# Altium schematic sheet Sheet_1_2021-08-28_22-45-47.schdoc
size 304 x 175 mm
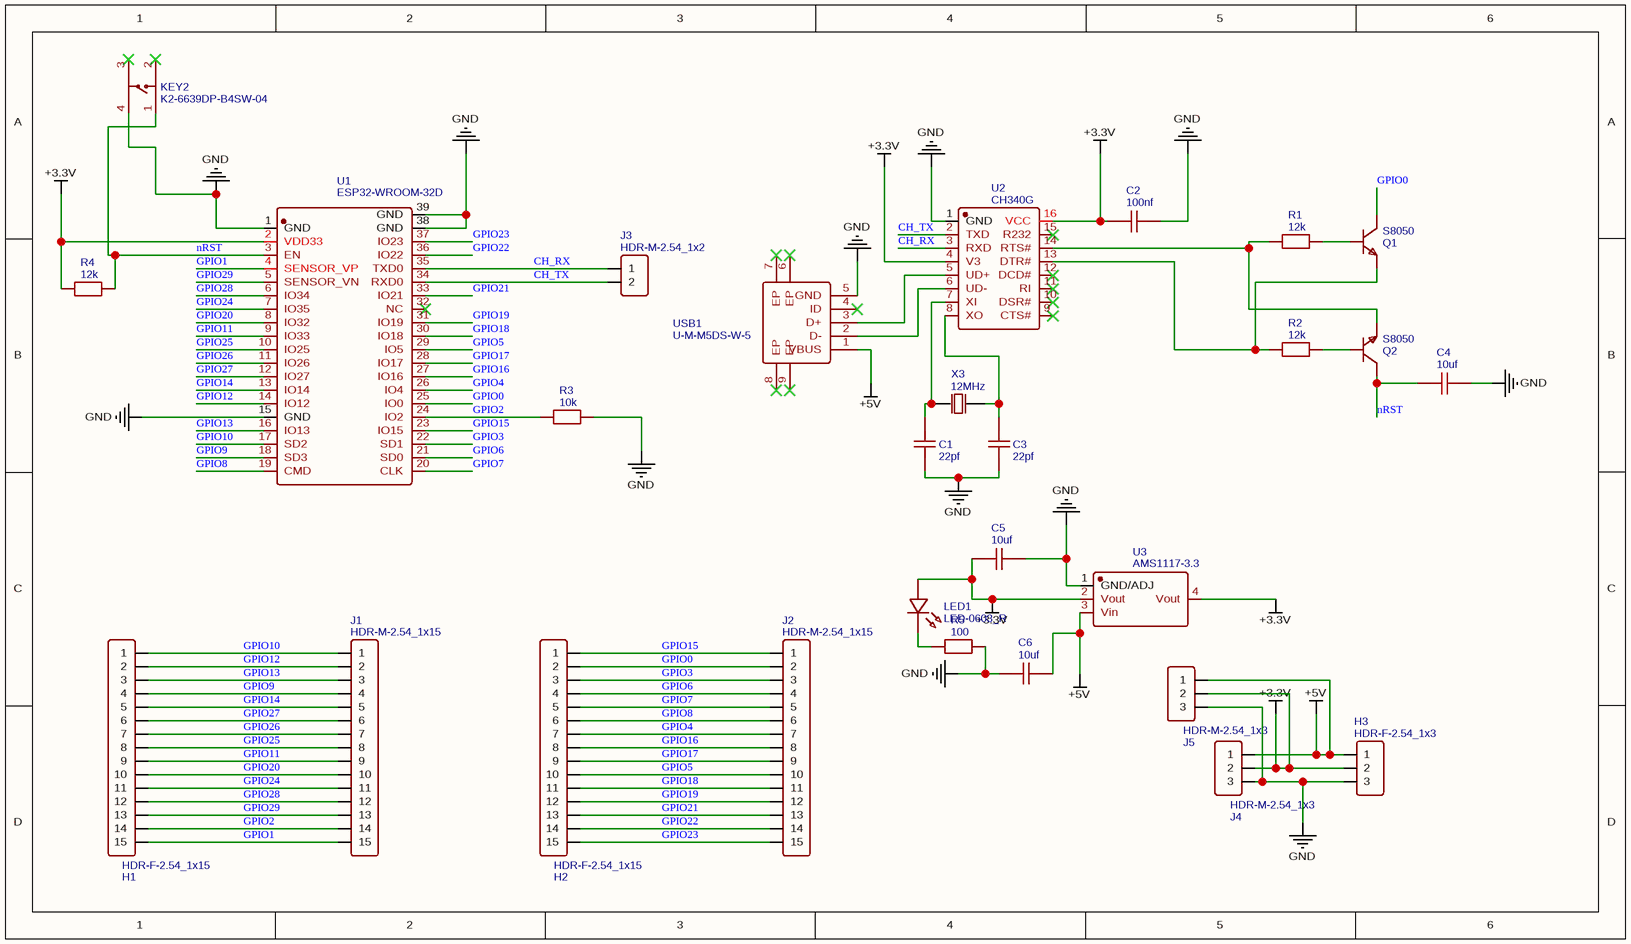
[diagram p0: Sheet_1_2021-08-28_22-45-47.schdoc]

## Parts
C1  22pf  [CAP-TH_L5.0-W5.0-P5.08-D1.0-L]
C2  100nf  [CAP-TH_L5.0-W5.0-P5.08-D1.0-L]
C3  22pf  [CAP-TH_L5.0-W5.0-P5.08-D1.0-L]
C4  10uf  [CAP-TH_L5.0-W5.0-P5.08-D1.0-L]
C5  10uf  [CAP-TH_L5.0-W5.0-P5.08-D1.0-L]
C6  10uf  [CAP-TH_L5.0-W5.0-P5.08-D1.0-L]
H1  HDR-F-2.54_1x15  [HDR-F-2.54_1X15]
H2  HDR-F-2.54_1x15  [HDR-F-2.54_1X15]
H3  HDR-F-2.54_1x3  [HDR-F-2.54_1X3]
J1  HDR-M-2.54_1x15  [HDR-M-2.54_1X15]
J2  HDR-M-2.54_1x15  [HDR-M-2.54_1X15]
J3  HDR-M-2.54_1x2  [HDR-M-2.54_1X2]
J4  HDR-M-2.54_1x3  [HDR-M-2.54_1X3]
J5  HDR-M-2.54_1x3  [HDR-M-2.54_1X3]
KEY2  K2-6639DP-B4SW-04  [KEY-TH_4P-L6.0-W6.0-P4.50-LS7.5]
LED1  LED-0603_R  [LED0603_RED]
Q1  S8050  [SOT-23-3_L2.9-W1.3-P1.90-LS2.4-BR]
Q2  S8050  [SOT-23-3_L2.9-W1.3-P1.90-LS2.4-BR]
R1  12k  [R0603]
R2  12k  [R0603]
R3  10k  [R0603]
R4  12k  [R0603]
R5  100  [R0603]
U1  ESP32-WROOM-32D  [WIFIM-SMD_39P-L25.5-W18.0-P1.27-BL]
U2  CH340G  [SOIC-16_L9.9-W3.9-P1.27-LS6.0-BR]
U3  AMS1117-3.3  [SOT-223-3_L6.5-W3.4-P2.30-LS7.0-BR]
USB1  U-M-M5DS-W-5  [USB-SMD_U-M-M5DS-W-5]
X3  12MHz  [HC-49US_L11.5-W4.5-P4.88]

## Nets
+3.3V: C2.1 C5.1 H3.2 J4.2 J5.2 LED1.1 R4.1 U1.2(VDD33) U2.4(V3) U2.16(VCC) U3.2(Vout) U3.4(Vout)
+5V: C6.2 H3.1 J4.1 J5.1 U3.3(Vin) USB1.1(VBUS)
GND: C1.1 C2.2 C3.1 C4.2 C5.2 C6.1 H3.3 J4.3 J5.3 KEY2.4 R3.2 R5.2 U1.1(GND) U1.15(GND) U1.38(GND) U1.39(GND) U2.1(GND) U3.1(GND/ADJ) USB1.5(GND)
CH_RX: J3.1 U1.35(TXD0) U2.3(RXD)
CH_TX: J3.2 U1.34(RXD0) U2.2(TXD)
GPIO0: H2.2 J2.2 Q1.3(C) U1.25(IO0)
GPIO1: H1.15 J1.15 U1.4(SENSOR_VP)
GPIO2: H1.14 J1.14 R3.1 U1.24(IO2)
GPIO3: H2.3 J2.3 U1.22(SD1)
GPIO4: H2.7 J2.7 U1.26(IO4)
GPIO5: H2.10 J2.10 U1.29(IO5)
GPIO6: H2.4 J2.4 U1.21(SD0)
GPIO7: H2.5 J2.5 U1.20(CLK)
GPIO8: H2.6 J2.6 U1.19(CMD)
GPIO9: H1.4 J1.4 U1.18(SD3)
GPIO10: H1.1 J1.1 U1.17(SD2)
GPIO11: H1.9 J1.9 U1.9(IO33)
GPIO12: H1.2 J1.2 U1.14(IO12)
GPIO13: H1.3 J1.3 U1.16(IO13)
GPIO14: H1.5 J1.5 U1.13(IO14)
GPIO15: H2.1 J2.1 U1.23(IO15)
GPIO16: H2.8 J2.8 U1.27(IO16)
GPIO17: H2.9 J2.9 U1.28(IO17)
GPIO18: H2.11 J2.11 U1.30(IO18)
GPIO19: H2.12 J2.12 U1.31(IO19)
GPIO20: H1.10 J1.10 U1.8(IO32)
GPIO21: H2.13 J2.13 U1.33(IO21)
GPIO22: H2.14 J2.14 U1.36(IO22)
GPIO23: H2.15 J2.15 U1.37(IO23)
GPIO24: H1.11 J1.11 U1.7(IO35)
GPIO25: H1.8 J1.8 U1.10(IO25)
GPIO26: H1.7 J1.7 U1.11(IO26)
GPIO27: H1.6 J1.6 U1.12(IO27)
GPIO28: H1.12 J1.12 U1.6(IO34)
GPIO29: H1.13 J1.13 U1.5(SENSOR_VN)
nRST: C4.1 KEY2.1 Q2.3(C) R4.2 U1.3(EN)
NetC1_2: C1.2 U2.7(XI) X3.1(OSC1)
NetC3_2: C3.2 U2.8(XO) X3.2(OSC2)
NetLED1_2: LED1.2 R5.1
NetQ1_1: Q1.1(B) R1.2
NetQ1_2: Q1.2(E) R2.1 U2.13(DTR#)
NetQ2_1: Q2.1(B) R2.2
NetQ2_2: Q2.2(E) R1.1 U2.14(RTS#)
NetU2_5: U2.5(UD+) USB1.3(D+)
NetU2_6: U2.6(UD-) USB1.2(D-)

Not connected (* = marked no-connect by the designer): KEY2 2* 3*; U1 32(NC)*; U2 9(CTS#)* 10(DSR#)* 11(RI)* 12(DCD#)* 15(R232)*; USB1 4(ID)* 6(EP)* 7(EP)* 8(EP)* 9(EP)*

## Library data of the parts
C1 C3 = 22pf: BOM_Manufacturer: Dersonic(德尔创); BOM_Manufacturer Part: CC1H223ZC1FD3F4D1000; Contributor: LCSC; BOM_Supplier: LCSC; BOM_Supplier Part: C377845; spicePre: C; spiceSymbolName: CC1H223ZC1FD3F4D1000
C2 = 100nf: BOM_Manufacturer: Dersonic(德尔创); BOM_Manufacturer Part: CC1H223ZC1FD3F4D1000; Contributor: LCSC; BOM_Supplier: LCSC; BOM_Supplier Part: C377845; spicePre: C; spiceSymbolName: CC1H223ZC1FD3F4D1000
C4-C6 = 10uf: BOM_Manufacturer: Dersonic(德尔创); BOM_Manufacturer Part: CC1H223ZC1FD3F4D1000; Contributor: LCSC; BOM_Supplier: LCSC; BOM_Supplier Part: C377845; spicePre: C; spiceSymbolName: CC1H223ZC1FD3F4D1000
H1 H2 = HDR-F-2.54_1x15: Contributor: LCEDA_Lib; BOM_Supplier Part: C124408; BOM_Supplier: LCSC; spicePre: H; spiceSymbolName: HDR-F-2.54_1x15
H3 = HDR-F-2.54_1x3: Contributor: LCEDA_Lib; BOM_Supplier Part: C146690; BOM_Supplier: LCSC; spicePre: H; spiceSymbolName: HDR-F-2.54_1x3
J1 J2 = HDR-M-2.54_1x15: Contributor: LCEDA_Lib; BOM_Supplier Part: C124373; BOM_Supplier: LCSC; spicePre: J; spiceSymbolName: HDR-M-2.54_1x15
J3 = HDR-M-2.54_1x2: Contributor: LCEDA_Lib; BOM_Supplier Part: C124375; BOM_Supplier: LCSC; spicePre: J; spiceSymbolName: HDR-M-2.54_1x2
J4 J5 = HDR-M-2.54_1x3: Contributor: LCEDA_Lib; BOM_Supplier Part: C180248; BOM_Supplier: LCSC; spicePre: J; spiceSymbolName: HDR-M-2.54_1x3
KEY2 = K2-6639DP-B4SW-04: BOM_Manufacturer: HRO; BOM_Supplier: LCSC; BOM_Manufacturer Part: K2-6639DP-B4SW-04; BOM_Supplier Part: C83205; BOM_JLCPCB Part Class: Extended Part; spicePre: K; spiceSymbolName: K2-6639DP-B4SW-04
LED1 = LED-0603_R: BOM_Manufacturer: EVERLIGHT(台湾亿光); BOM_Manufacturer Part: 19-217/R6C-AL1M2VY/3T; Contributor: LCEDA_01; BOM_Supplier Part: C72044; BOM_Supplier: LCSC; spicePre: L; spiceSymbolName: LED-0603_R
Q1 Q2 = S8050: BOM_Manufacturer: JSMSEMI; Contributor: LCSC; BOM_Supplier: LCSC; BOM_Supplier Part: C916390; BOM_Manufacturer Part: S8050; BOM_JLCPCB Part Class: Extended Part; spicePre: Q; spiceSymbolName: S8050
R1 R2 R4 = 12k: nameAlias: Value(Ω); Contributor: LCEDA_Lib; spicePre: R; spiceSymbolName: R_0603_EU
R3 = 10k: nameAlias: Value(Ω); Contributor: LCEDA_Lib; spicePre: R; spiceSymbolName: R_0603_EU
R5 = 100: nameAlias: Value(Ω); Contributor: LCEDA_Lib; spicePre: R; spiceSymbolName: R_0603_EU
U1 = ESP32-WROOM-32D: BOM_Manufacturer: ESPRESSIF 乐鑫; Contributor: LCSC; BOM_Supplier: LCSC; BOM_Supplier Part: C473012; BOM_Manufacturer Part: ESP32-WROOM-32D; BOM_JLCPCB Part Class: Extended Part; spicePre: U; spiceSymbolName: ESP32-WROOM-32D
U2 = CH340G: BOM_Manufacturer: WCH; timeStamp: 1468327462; BOM_Supplier: LCSC; BOM_Manufacturer Part: CH340G; BOM_Supplier Part: C14267; BOM_JLCPCB Part Class: Basic Part; spicePre: U; spiceSymbolName: CH340G
U3 = AMS1117-3.3: BOM_Manufacturer: AMS; sourceId: dwIGgezVh; timeStamp: 1476261164; BOM_Supplier: LCSC; BOM_Manufacturer Part: AMS1117-3.3; BOM_Supplier Part: C6186; BOM_JLCPCB Part Class: Basic Part; spicePre: U; spiceSymbolName: AMS1117-3.3
USB1 = U-M-M5DS-W-5: BOM_Manufacturer: HRO; Contributor: LCSC; BOM_Supplier: LCSC; BOM_Manufacturer Part: U-M-M5DS-W-5; BOM_Supplier Part: C145777; spicePre: U; spiceSymbolName: U-M-M5DS-W-5
X3 = 12MHz: BOM_Manufacturer: YXC; BOM_Manufacturer Part: X49SD12MSD2SC; nameAlias: Frequency; BOM_Supplier: LCSC; BOM_Supplier Part: C16369; spicePre: X; spiceSymbolName: X49SD12MSD2SC